# EAGLE design joule_thief_v5 (EAGLE 6.3)
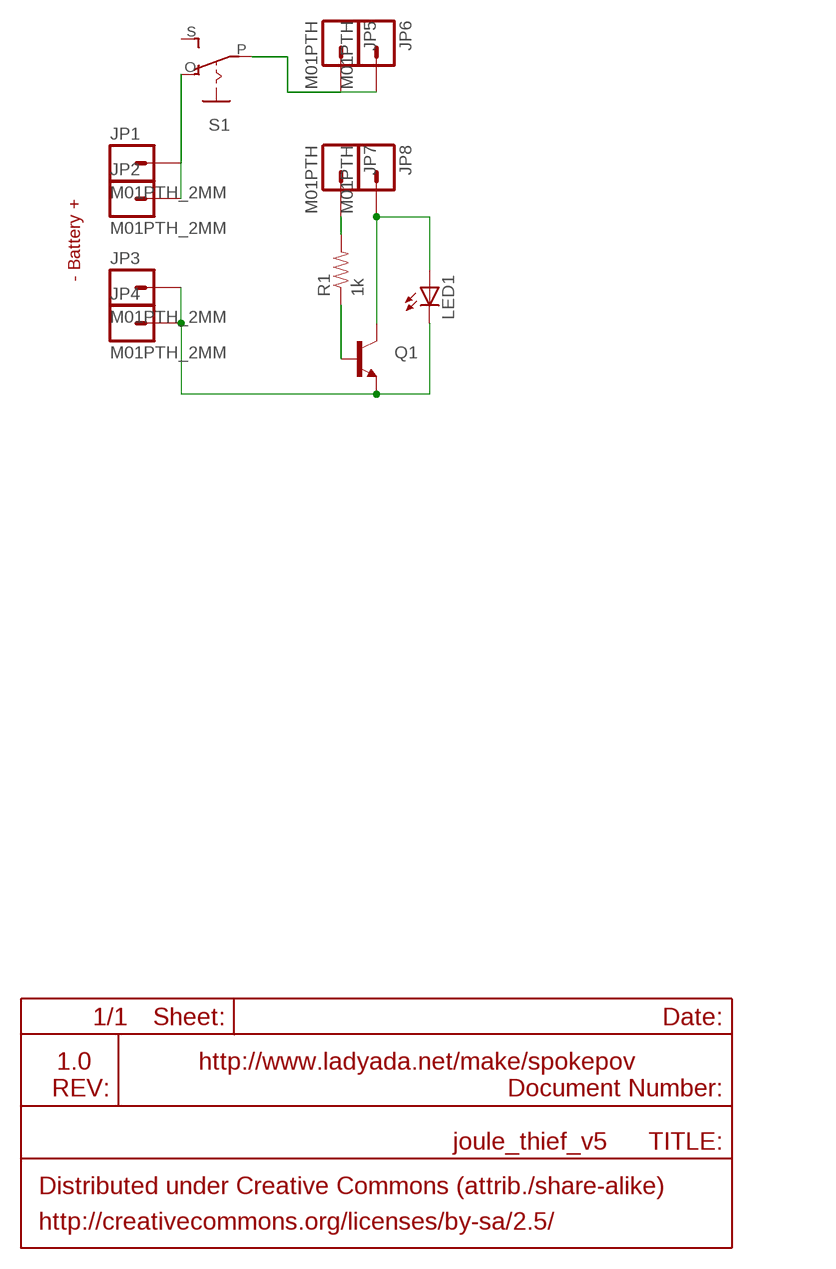
[diagram p0: schematic, sheet 1]

## Parts
JP1  M01PTH_2MM  [1X01_2MM]
JP2  M01PTH_2MM  [1X01_2MM]
JP3  M01PTH_2MM  [1X01_2MM]
JP4  M01PTH_2MM  [1X01_2MM]
JP5  M01PTH  [1X01]
JP6  M01PTH  [1X01]
JP7  M01PTH  [1X01]
JP8  M01PTH  [1X01]
LED1  LED5MM  [LED5MM]
Q1  TRANSISTOR_NPNTO-92-AMMO  [TO-92-AMMO]
R1  1k  RESISTORAXIAL-0.3  [AXIAL-0.3]
S1  EG1218S  [EG1218]

## Nets
N$1: JP8.1 LED1.A Q1.3(C)
N$2: JP7.1 R1.P$2
N$3: Q1.2(B) R1.P$1
N$4: JP1.1 JP2.1 S1.O
N$5: JP5.1 JP6.1 S1.P
N$7: JP3.1 JP4.1 LED1.K(C) Q1.1(E)
Unconnected: S1.S

## Notes on the sheet
- - Battery +
- 1.0 | http://www.ladyada.net/make/spokepov
- Distributed under Creative Commons (attrib./share-alike)
- http://creativecommons.org/licenses/by-sa/2.5/

## Library data of the parts
JP1-JP8 = SparkFun:M01: Header 1 Standard 1-pin 0.1" header. Use with straight break away headers (SKU : PRT-00116), right angle break away headers (PRT-00553), swiss pins (PRT-00743), machine pins (PRT-00117), and female headers (PRT-00115).
LED1 = adafruit:LED: LED OSRAM: - CHIPLED LG R971, LG N971, LY N971, LG Q971, LY Q971, LO R971, LY R971 LH N974, LH R974 LS Q976, LO Q976, LY Q976 LO Q996 - Hyper CHIPLED LW Q18S LB Q993, LB Q99A, LB R99A - SideLED LS A670, LO A670, LY A670, LG A670, LP A670 LB A673, LV A673, LT A673, LW A673 LH A674 LY A675 LS A676, LA A676, LO A676, LY A676, LW A676 LS A679, LY A679, LG A679 - Hyper Micro SIDELED® LS Y876, LA Y876, LO Y876, LY Y876 LT Y87S - SmartLED LW L88C, LW L88S LB L89C, LB L89S, LG L890 LS L89K, LO L89K, LY L89K LS L896, LA L896, LO L896, LY L896 - TOPLED LS T670, LO T670, LY T670, LG T670, LP T670 LSG T670, LSP T670, LSY T670, LOP T670, LYG T670 LG T671, LOG T671, LSG T671 LB T673, LV T673, LT T673, LW T673 LH T674 LS T676, LA T676, LO T676, LY T676, LB T676, LH T676, LSB T676, LW T676 LB T67C, LV T67C, LT T67C, LS T67K, LO T67K, LY T67K, LW E67C LS E67B, LA E67B, LO E67B, LY E67B, LB E67C, LV E67C, LT E67C LW T67C LS T679, LY T679, LG T679 LS T770, LO T770, LY T770, LG T770, LP T770 LB T773, LV T773, LT T773, LW T773 LH T774 LS E675, LA E675, LY E675, LS T675 LS T776, LA T776, LO T776, LY T776, LB T776 LHGB T686 LT T68C, LB T68C - Hyper Mini TOPLED® LB M676 - Mini TOPLED Santana® LG M470 LS M47K, LO M47K, LY M47K Source: http://www.osram.convergy.de/
Q1 = SparkFun-DiscreteSemi:TRANSISTOR_NPN: Generic NPN BJT. MMBT2222 is the common NPN we use. Double check against datasheet- not all devices are the same!
R1 = SparkFun:RESISTOR: Resistor Basic schematic elements and footprints for 0603, 1206, and PTH resistors.
S1 = adafruit:EG1218: SLIDING SWITCH 0.1" spacing through hole, vertical SPDT slide switch http://www.ladyada.net/library/pcb/eaglelibrary.html

## Board
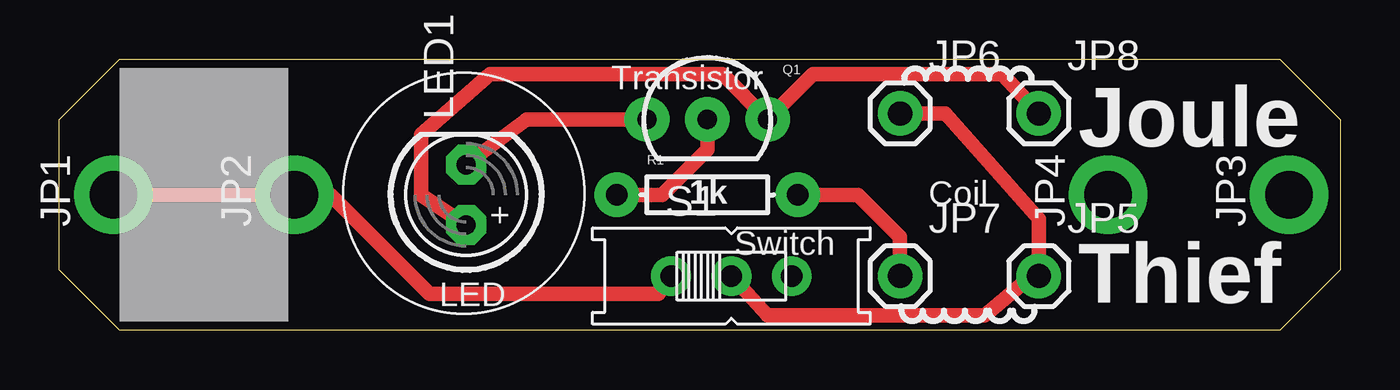
[diagram p1: board, top side]
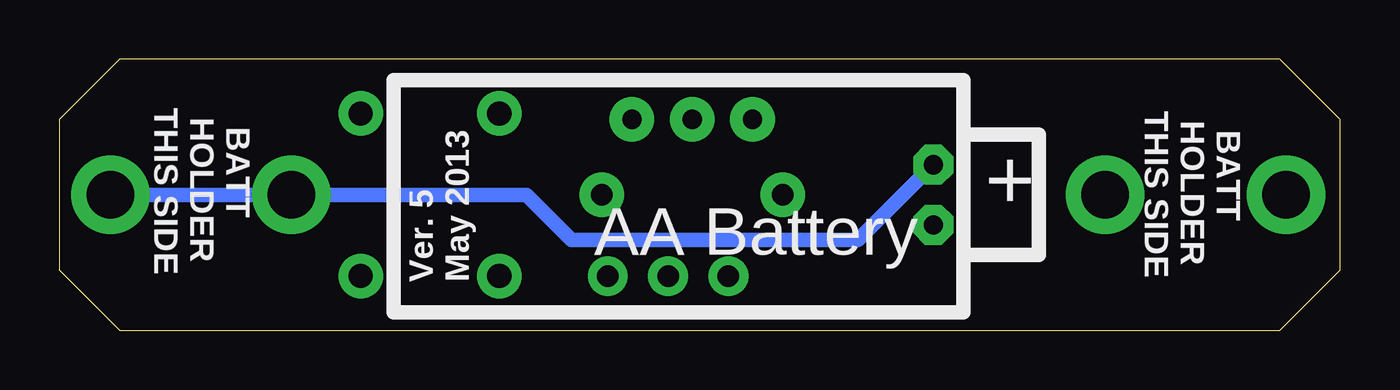
[diagram p2: board, bottom side, seen from below]

Size 53.98 x 11.43 mm. Coordinates in mm from the lower left corner, seen from the top.
Outline: 0,2.54 0,8.89 2.54,11.43 51.43,11.43 53.98,8.89 53.98,2.54 51.43,0 2.54,0 0,2.54
Copper layers (1*16): Top 0.035mm / dielectric 1.5mm / Bottom 0.035mm
Design rules "SparkFun": minimum track width 8mil, minimum drill 20mil, track to track 8mil, track to pad 8mil, pad to pad 8mil, via to via 8mil, smd to smd 8mil, copper to edge 10mil, drill to drill 8mil, minimum pad ring 12mil, minimum via ring 10mil, stop-mask expansion 4mil, vias tented up to drill 25mil, thermal gap 10mil

### Footprints (pad centres in the part's own frame; a part is rotated, then mirrored left to right if it is on the bottom)
1X01_2MM = drill 2 pad 3.302: 1 0,0
1X01 = drill 1.016 pad 1.88: 1 0,0
LED5MM = drill 0.813 pad 1.676 octagon: A -1.27,0; K 1.27,0
TO-92-AMMO = drill 0.813 pad 1.88: 1 -2.54,0; 2 0,0; 3 2.54,0
AXIAL-0.3 = drill 0.9 pad 1.88: P$1 -3.81,0; P$2 3.81,0
EG1218 = drill 0.9 pad 1.676: O -2.54,0; P 0,0; S 2.54,0

### Placement (x,y rotation side)
JP1  2.29,5.72 90 top
JP2  9.91,5.72 90 top
JP3  51.82,5.72 90 top
JP4  44.2,5.72 90 top
JP5  41.27,2.29 0 top
JP6  35.43,9.14 0 top
JP7  35.43,2.29 0 top
JP8  41.27,9.14 0 top
LED1  17.15,5.72 90 top
Q1  27.3,8.89 0 top
R1  27.3,5.72 0 top
S1  28.32,2.29 0 top

### Tracks (layer width: path | path; a pad name or v marks a point on that pad's centre or on a via)
N$1
  Top 0.61: LED1.A 15.24,5.72 15.24,8.26 18.15,10.8 27.94,10.8 Q1.3 31.75,10.8 39.75,10.8 JP8.1
N$2
  Top 0.61: JP7.1 35.43,3.94 33.66,5.72 R1.P$2
N$3
  Top 0.61: R1.P$1 25.4,5.72 27.3,7.62 Q1.2
N$4
  Top 0.61: JP1.1 JP2.1 11.43,5.72 15.6,1.54 25.26,1.54 S1.O
N$5
  Top 0.61: S1.P 29.84,0.63 39.01,0.63 41.27,2.54 JP5.1 41.27,4.7 37.34,9.14 JP6.1
N$7
  Top 0.61: Q1.1 19.69,8.89 LED1.K
  Bottom 0.61: LED1.K 20.32,3.81 32.38,3.81 34.29,5.72 JP4.1 JP3.1

### Text on the board
tPlace: Transistor | Joule | Coil | + | Switch | LED | Thief
bPlace: BATT / HOLDER / THIS SIDE | BATT / HOLDER / THIS SIDE | + | AA Battery | Ver. 5 / May 2013